# EAGLE design MicroWordClock2 (EAGLE 9.4.2)
Assembly variants: Wordface

## Sheet 1 of 3: COMPUTE
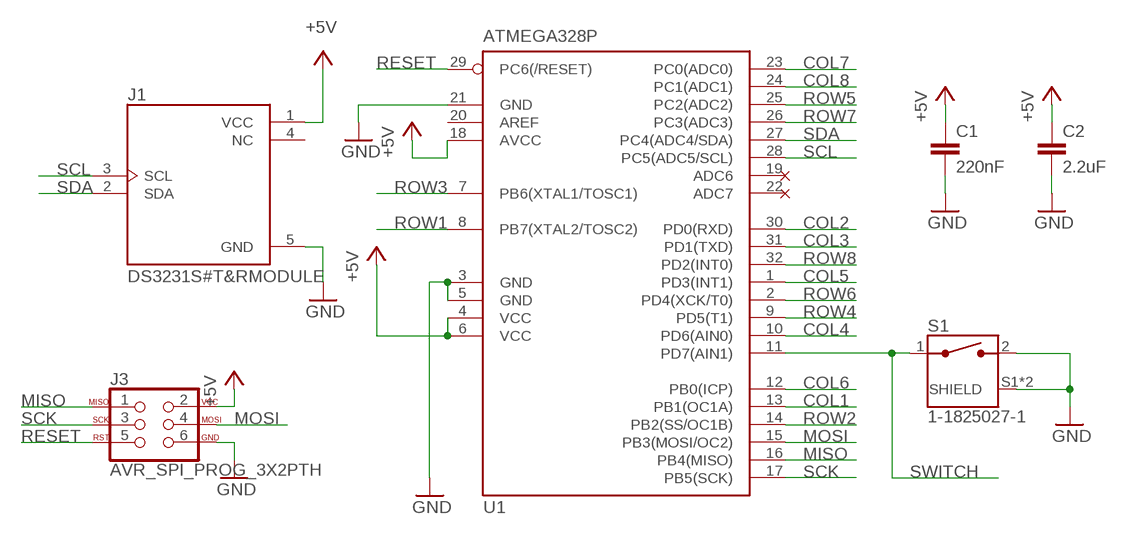
[diagram p0: schematic, sheet 1]

### Parts
C1  220nF  C-EUC0603  [C0603]
C2  2.2uF  C-EUC0603  [C0603]
J1  DS3231S#T&RMODULE  [1X05]
J3  AVR_SPI_PROG_3X2PTH  [2X3]
S1  1-1825027-1  [SW_1-1825027-1]
U1  ATMEGA328P  MEGA8-AI  [TQFP32-08]

### Nets
+5V: C1.1 C2.1 J1.1(VCC) J3.2 U1.4(VCC) U1.6(VCC) U1.18(AVCC) ; also sheet 3
COL1: U1.13(PB1(OC1A)) ; also sheet 2
COL2: U1.30(PD0(RXD)) ; also sheet 2
COL3: U1.31(PD1(TXD)) ; also sheet 2
COL4: U1.10(PD6(AIN0)) ; also sheet 2
COL5: U1.1(PD3(INT1)) ; also sheet 2
COL6: U1.12(PB0(ICP)) ; also sheet 2
COL7: U1.23(PC0(ADC0)) ; also sheet 2
COL8: U1.24(PC1(ADC1)) ; also sheet 2
GND: C1.2 C2.2 J1.5(GND) J3.6 S1.2 S1.S1(SHIELD) S1.S2(SHIELD) U1.3(GND) U1.5(GND) U1.21(GND) ; also sheet 3
MISO: J3.1 U1.16(PB4(MISO))
MOSI: J3.4 U1.15(PB3(MOSI/OC2))
RESET: J3.5 U1.29(PC6(/RESET))
ROW1: U1.8(PB7(XTAL2/TOSC2)) ; also sheet 2
ROW2: U1.14(PB2(SS/OC1B)) ; also sheet 2
ROW3: U1.7(PB6(XTAL1/TOSC1)) ; also sheet 2
ROW4: U1.9(PD5(T1)) ; also sheet 2
ROW5: U1.25(PC2(ADC2)) ; also sheet 2
ROW6: U1.2(PD4(XCK/T0)) ; also sheet 2
ROW7: U1.26(PC3(ADC3)) ; also sheet 2
ROW8: U1.32(PD2(INT0)) ; also sheet 2
SCK: J3.3 U1.17(PB5(SCK))
SCL: J1.3(SCL) U1.28(PC5(ADC5/SCL))
SDA: J1.2(SDA) U1.27(PC4(ADC4/SDA))
SWITCH: S1.1 U1.11(PD7(AIN1)) ; also sheet 3
Unconnected: J1.4(NC) U1.19(ADC6) U1.20(AREF) U1.22(ADC7)

## Sheet 2 of 3: MULTIPLEXED LEDS
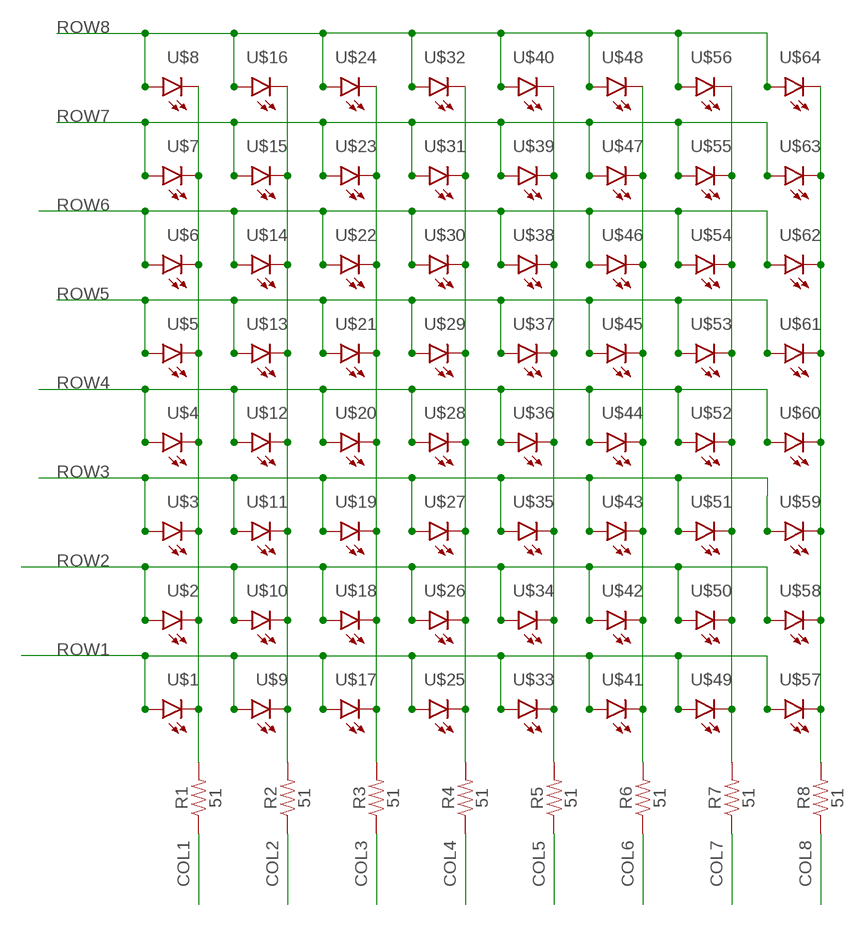
[diagram p1: schematic, sheet 2]

### Parts
R1  51  470OHM-0603-1/10W-1%  [0603]
R2  51  470OHM-0603-1/10W-1%  [0603]
R3  51  470OHM-0603-1/10W-1%  [0603]
R4  51  470OHM-0603-1/10W-1%  [0603]
R5  51  470OHM-0603-1/10W-1%  [0603]
R6  51  470OHM-0603-1/10W-1%  [0603]
R7  51  470OHM-0603-1/10W-1%  [0603]
R8  51  470OHM-0603-1/10W-1%  [0603]
U$1  WHITE  JE2835AWT-00-0000-0B0A0BG840E  [1113(2835METRIC)]
U$2  WHITE  JE2835AWT-00-0000-0B0A0BG840E  [1113(2835METRIC)]
U$3  WHITE  JE2835AWT-00-0000-0B0A0BG840E  [1113(2835METRIC)]
U$4  WHITE  JE2835AWT-00-0000-0B0A0BG840E  [1113(2835METRIC)]
U$5  WHITE  JE2835AWT-00-0000-0B0A0BG840E  [1113(2835METRIC)]
U$6  WHITE  JE2835AWT-00-0000-0B0A0BG840E  [1113(2835METRIC)]
U$7  WHITE  JE2835AWT-00-0000-0B0A0BG840E  [1113(2835METRIC)]
U$8  WHITE  JE2835AWT-00-0000-0B0A0BG840E  [1113(2835METRIC)]
U$9  WHITE  JE2835AWT-00-0000-0B0A0BG840E  [1113(2835METRIC)]
U$10  WHITE  JE2835AWT-00-0000-0B0A0BG840E  [1113(2835METRIC)]
U$11  WHITE  JE2835AWT-00-0000-0B0A0BG840E  [1113(2835METRIC)]
U$12  WHITE  JE2835AWT-00-0000-0B0A0BG840E  [1113(2835METRIC)]
U$13  WHITE  JE2835AWT-00-0000-0B0A0BG840E  [1113(2835METRIC)]
U$14  WHITE  JE2835AWT-00-0000-0B0A0BG840E  [1113(2835METRIC)]
U$15  WHITE  JE2835AWT-00-0000-0B0A0BG840E  [1113(2835METRIC)]
U$16  WHITE  JE2835AWT-00-0000-0B0A0BG840E  [1113(2835METRIC)]
U$17  WHITE  JE2835AWT-00-0000-0B0A0BG840E  [1113(2835METRIC)]
U$18  WHITE  JE2835AWT-00-0000-0B0A0BG840E  [1113(2835METRIC)]
U$19  WHITE  JE2835AWT-00-0000-0B0A0BG840E  [1113(2835METRIC)]
U$20  WHITE  JE2835AWT-00-0000-0B0A0BG840E  [1113(2835METRIC)]
U$21  WHITE  JE2835AWT-00-0000-0B0A0BG840E  [1113(2835METRIC)]
U$22  WHITE  JE2835AWT-00-0000-0B0A0BG840E  [1113(2835METRIC)]
U$23  WHITE  JE2835AWT-00-0000-0B0A0BG840E  [1113(2835METRIC)]
U$24  WHITE  JE2835AWT-00-0000-0B0A0BG840E  [1113(2835METRIC)]
U$25  WHITE  JE2835AWT-00-0000-0B0A0BG840E  [1113(2835METRIC)]
U$26  WHITE  JE2835AWT-00-0000-0B0A0BG840E  [1113(2835METRIC)]
U$27  WHITE  JE2835AWT-00-0000-0B0A0BG840E  [1113(2835METRIC)]
U$28  WHITE  JE2835AWT-00-0000-0B0A0BG840E  [1113(2835METRIC)]
U$29  WHITE  JE2835AWT-00-0000-0B0A0BG840E  [1113(2835METRIC)]
U$30  WHITE  JE2835AWT-00-0000-0B0A0BG840E  [1113(2835METRIC)]
U$31  WHITE  JE2835AWT-00-0000-0B0A0BG840E  [1113(2835METRIC)]
U$32  WHITE  JE2835AWT-00-0000-0B0A0BG840E  [1113(2835METRIC)]
U$33  WHITE  JE2835AWT-00-0000-0B0A0BG840E  [1113(2835METRIC)]
U$34  WHITE  JE2835AWT-00-0000-0B0A0BG840E  [1113(2835METRIC)]
U$35  WHITE  JE2835AWT-00-0000-0B0A0BG840E  [1113(2835METRIC)]
U$36  WHITE  JE2835AWT-00-0000-0B0A0BG840E  [1113(2835METRIC)]  (not fitted in variant Wordface)
U$37  WHITE  JE2835AWT-00-0000-0B0A0BG840E  [1113(2835METRIC)]
U$38  WHITE  JE2835AWT-00-0000-0B0A0BG840E  [1113(2835METRIC)]
U$39  WHITE  JE2835AWT-00-0000-0B0A0BG840E  [1113(2835METRIC)]
U$40  WHITE  JE2835AWT-00-0000-0B0A0BG840E  [1113(2835METRIC)]
U$41  WHITE  JE2835AWT-00-0000-0B0A0BG840E  [1113(2835METRIC)]
U$42  WHITE  JE2835AWT-00-0000-0B0A0BG840E  [1113(2835METRIC)]
U$43  WHITE  JE2835AWT-00-0000-0B0A0BG840E  [1113(2835METRIC)]
U$44  WHITE  JE2835AWT-00-0000-0B0A0BG840E  [1113(2835METRIC)]
U$45  WHITE  JE2835AWT-00-0000-0B0A0BG840E  [1113(2835METRIC)]
U$46  WHITE  JE2835AWT-00-0000-0B0A0BG840E  [1113(2835METRIC)]
U$47  WHITE  JE2835AWT-00-0000-0B0A0BG840E  [1113(2835METRIC)]
U$48  WHITE  JE2835AWT-00-0000-0B0A0BG840E  [1113(2835METRIC)]
U$49  WHITE  JE2835AWT-00-0000-0B0A0BG840E  [1113(2835METRIC)]
U$50  WHITE  JE2835AWT-00-0000-0B0A0BG840E  [1113(2835METRIC)]
U$51  WHITE  JE2835AWT-00-0000-0B0A0BG840E  [1113(2835METRIC)]
U$52  WHITE  JE2835AWT-00-0000-0B0A0BG840E  [1113(2835METRIC)]
U$53  WHITE  JE2835AWT-00-0000-0B0A0BG840E  [1113(2835METRIC)]
U$54  WHITE  JE2835AWT-00-0000-0B0A0BG840E  [1113(2835METRIC)]
U$55  WHITE  JE2835AWT-00-0000-0B0A0BG840E  [1113(2835METRIC)]
U$56  WHITE  JE2835AWT-00-0000-0B0A0BG840E  [1113(2835METRIC)]
U$57  WHITE  JE2835AWT-00-0000-0B0A0BG840E  [1113(2835METRIC)]
U$58  WHITE  JE2835AWT-00-0000-0B0A0BG840E  [1113(2835METRIC)]
U$59  WHITE  JE2835AWT-00-0000-0B0A0BG840E  [1113(2835METRIC)]  (not fitted in variant Wordface)
U$60  WHITE  JE2835AWT-00-0000-0B0A0BG840E  [1113(2835METRIC)]  (not fitted in variant Wordface)
U$61  WHITE  JE2835AWT-00-0000-0B0A0BG840E  [1113(2835METRIC)]
U$62  WHITE  JE2835AWT-00-0000-0B0A0BG840E  [1113(2835METRIC)]
U$63  WHITE  JE2835AWT-00-0000-0B0A0BG840E  [1113(2835METRIC)]
U$64  WHITE  JE2835AWT-00-0000-0B0A0BG840E  [1113(2835METRIC)]

### Nets
COL1: R1.1 ; also sheet 1
COL2: R2.1 ; also sheet 1
COL3: R3.1 ; also sheet 1
COL4: R4.1 ; also sheet 1
COL5: R5.1 ; also sheet 1
COL6: R6.1 ; also sheet 1
COL7: R7.1 ; also sheet 1
COL8: R8.1 ; also sheet 1
EE: R8.2 U$57.CATHODE(C) U$58.CATHODE(C) U$59.CATHODE(C) U$60.CATHODE(C) U$61.CATHODE(C) U$62.CATHODE(C) U$63.CATHODE(C) U$64.CATHODE(C)
N$5: R3.2 U$17.CATHODE(C) U$18.CATHODE(C) U$19.CATHODE(C) U$20.CATHODE(C) U$21.CATHODE(C) U$22.CATHODE(C) U$23.CATHODE(C) U$24.CATHODE(C)
N$6: R4.2 U$25.CATHODE(C) U$26.CATHODE(C) U$27.CATHODE(C) U$28.CATHODE(C) U$29.CATHODE(C) U$30.CATHODE(C) U$31.CATHODE(C) U$32.CATHODE(C)
N$7: R5.2 U$33.CATHODE(C) U$34.CATHODE(C) U$35.CATHODE(C) U$36.CATHODE(C) U$37.CATHODE(C) U$38.CATHODE(C) U$39.CATHODE(C) U$40.CATHODE(C)
N$8: R6.2 U$41.CATHODE(C) U$42.CATHODE(C) U$43.CATHODE(C) U$44.CATHODE(C) U$45.CATHODE(C) U$46.CATHODE(C) U$47.CATHODE(C) U$48.CATHODE(C)
N$9: R7.2 U$49.CATHODE(C) U$50.CATHODE(C) U$51.CATHODE(C) U$52.CATHODE(C) U$53.CATHODE(C) U$54.CATHODE(C) U$55.CATHODE(C) U$56.CATHODE(C)
N$11: R1.2 U$1.CATHODE(C) U$2.CATHODE(C) U$3.CATHODE(C) U$4.CATHODE(C) U$5.CATHODE(C) U$6.CATHODE(C) U$7.CATHODE(C) U$8.CATHODE(C)
N$15: R2.2 U$9.CATHODE(C) U$10.CATHODE(C) U$11.CATHODE(C) U$12.CATHODE(C) U$13.CATHODE(C) U$14.CATHODE(C) U$15.CATHODE(C) U$16.CATHODE(C)
ROW1: U$1.ANODE(A) U$9.ANODE(A) U$17.ANODE(A) U$25.ANODE(A) U$33.ANODE(A) U$41.ANODE(A) U$49.ANODE(A) U$57.ANODE(A) ; also sheet 1
ROW2: U$2.ANODE(A) U$10.ANODE(A) U$18.ANODE(A) U$26.ANODE(A) U$34.ANODE(A) U$42.ANODE(A) U$50.ANODE(A) U$58.ANODE(A) ; also sheet 1
ROW3: U$3.ANODE(A) U$11.ANODE(A) U$19.ANODE(A) U$27.ANODE(A) U$35.ANODE(A) U$43.ANODE(A) U$51.ANODE(A) U$59.ANODE(A) ; also sheet 1
ROW4: U$4.ANODE(A) U$12.ANODE(A) U$20.ANODE(A) U$28.ANODE(A) U$36.ANODE(A) U$44.ANODE(A) U$52.ANODE(A) U$60.ANODE(A) ; also sheet 1
ROW5: U$5.ANODE(A) U$13.ANODE(A) U$21.ANODE(A) U$29.ANODE(A) U$37.ANODE(A) U$45.ANODE(A) U$53.ANODE(A) U$61.ANODE(A) ; also sheet 1
ROW6: U$6.ANODE(A) U$14.ANODE(A) U$22.ANODE(A) U$30.ANODE(A) U$38.ANODE(A) U$46.ANODE(A) U$54.ANODE(A) U$62.ANODE(A) ; also sheet 1
ROW7: U$7.ANODE(A) U$15.ANODE(A) U$23.ANODE(A) U$31.ANODE(A) U$39.ANODE(A) U$47.ANODE(A) U$55.ANODE(A) U$63.ANODE(A) ; also sheet 1
ROW8: U$8.ANODE(A) U$16.ANODE(A) U$24.ANODE(A) U$32.ANODE(A) U$40.ANODE(A) U$48.ANODE(A) U$56.ANODE(A) U$64.ANODE(A) ; also sheet 1

## Sheet 3 of 3: HEADERS
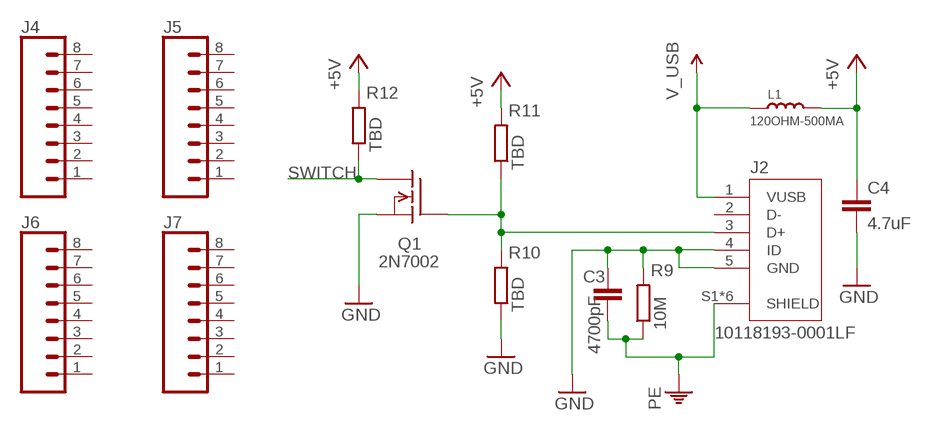
[diagram p2: schematic, sheet 3]

### Parts
C3  4700pF  C-EUC0603  [C0603]
C4  4.7uF  C-EUC0603  [C0603]
J2  10118193-0001LF  [FCI_10118193-0001LF]
J4  CONN_08"  [1X08]
J5  CONN_08"  [1X08]
J6  CONN_08"  [1X08]
J7  CONN_08"  [1X08]
L1  120OHM-500MA  SMD-FERRITE-CHIP-120-OHM-500MA(0603)  [L0603]
Q1  2N7002  [SOT23]
R9  10M  R-EU_R0603  [R0603]
R10  TBD  R-EU_R0603  [R0603]
R11  TBD  R-EU_R0603  [R0603]
R12  TBD  R-EU_R0603  [R0603]

### Nets
+5V: C4.1 L1.2 R11.2 R12.2 ; also sheet 1
GND: C3.1 C4.2 J2.4(ID) J2.5(GND) Q1.2(S) R9.2 R10.1 ; also sheet 1
N$1: J2.3(D+) Q1.1(G) R10.2 R11.1
PE: C3.2 J2.S1(SHIELD) J2.S2(SHIELD) J2.S3(SHIELD) J2.S4(SHIELD) J2.S5(SHIELD) J2.S6(SHIELD) R9.1
SWITCH: Q1.3(D) R12.1 ; also sheet 1
V_USB: J2.1(VUSB) L1.1
Unconnected: J2.2(D-) J4.1 J4.2 J4.3 J4.4 J4.5 J4.6 J4.7 J4.8 J5.1 J5.2 J5.3 J5.4 J5.5 J5.6 J5.7 J5.8 J6.1 J6.2 J6.3 J6.4 J6.5 J6.6 J6.7 J6.8 J7.1 J7.2 J7.3 J7.4 J7.5 J7.6 J7.7 J7.8

## Library data of the parts
C1-C4 = rcl:C-EU: CAPACITOR, European symbol; SPICEPREFIX: C
J1 = DS3231:DS3231S#T&R: Real Time Clock Serial 16-Pin SOIC W T/R
J2 = 10118193-0001LF:10118193-0001LF: Micro USB B Type Receptacle; DESCRIPTION: Single Port 5 Contact Shielded SMT MICRO USB B-Type Receptacle; DIGI-KEY_PART_NUMBER: 609-4616-1-ND; DIGI-KEY_PURCHASE_URL: https://www.digikey.com/product-detail/en/amphenol-icc-fci/10118193-0001LF/609-4616-1-ND/2785380?utm_source=snapeda&utm_medium=aggregator&utm_campaign=symbol; MF: Amphenol ICC; MP: 10118193-0001LF; PACKAGE: None
J3 = SparkFun-Connectors:AVR_SPI_PROG_3X2: AVR ISP 6 Pin This is the reduced ISP connector for AVR programming. Common on Arduino. This footprint will take up less PCB space and can be used with a 10-pin to 6-pin adapter such as SKU: BOB-08508 **Special note about "TEST_POINT" package. The stop mask is on the top side, so if you want your programming test points to be on the bottom of your board, make sure to place this package on the bottom side of the board. This also ensure that the orientation to program from the bottom side will be correct. SparkFun Products: SparkFun ISP Pogo Adapter <https://www.sparkfun.com/products/11591> - NS Tiny AVR Programmer <https://www.sparkfun.com/products/11801> -PTH
J4-J7 = SparkFun-Connectors:CONN_08: Multi connection point. Often used as Generic Header-pin footprint for 0.1 inch spaced/style header connections On any of the 0.1 inch spaced packages, you can populate with these: Break Away Headers - Straight <https://www.sparkfun.com/products/116> (PRT-00116) Break Away Male Headers - Right Angle <https://www.sparkfun.com/products/553> (PRT-00553) Female Headers <https://www.sparkfun.com/products/115> (PRT-00115) Break Away Headers - Machine Pin <https://www.sparkfun.com/products/117> (PRT-00117) Break Away Female Headers - Swiss Machine Pin <https://www.sparkfun.com/products/743> (PRT-00743) Arduino Stackable Header - 8 Pin <https://www.sparkfun.com/products/9279> (PRT-09279) For SCREWTERMINALS and SPRING TERMINALS visit here: Screw Terimnals on SparkFun.com <https://www.sparkfun.com/search/results?term=Screw+Terminals> (5mm/3.5mm/2.54mm spacing) This device is also useful as a general connection point to wire up your design to another part of your project. Our various solder wires solder well into these plated through hole pads. Hook-Up Wire - Assortment (Stranded, 22 AWG) <https://www.sparkfun.com/products/11375> (PRT-11375) Hook-Up Wire - Assortment (Solid Core, 22 AWG) <https://www.sparkfun.com/products/11367> (PRT-11367) View the entire wire category on our website here <https://www.sparkfun.com/categories/141> Special notes: Molex polarized connector foot print use with SKU : PRT-08231 with associated crimp pins and housings. 1MM SMD Version SKU: PRT-10208 NOTES ON THE VARIANTS LOCK and LOCK_LONGPADS... This footprint was designed to help hold the alignment of a through-hole component (i.e. 6-pin header) while soldering it into place. You may notice that each hole has been shifted either up or down by 0.005 of an inch from it's more standard position (which is a perfectly straight line). This slight alteration caused the pins (the squares in the middle) to touch the edges of the holes. Because they are alternating, it causes a "brace" to hold the component in place. 0.005 has proven to be the perfect amount of "off-center" position when using our standard breakaway headers. Although looks a little odd when you look at the bare footprint, once you have a header in there, the alteration is very hard to notice. Also,if you push a header all the way into place, it is covered up entirely on the bottom side.; PROD_ID: CONN-08438
L1 = OPL_Ferrite_and_Magnetic_Bead:SMD-FERRITE-CHIP-120-OHM-500MA(0603): 303030001; MPN: BLM18AG121SN1D
Q1 = 2N7002:2N7002; AVAILABILITY: Unavailable; DESCRIPTION: Transistor NPN Mos 2N7002 SILICONIX miliampere=100 V=60 SOt23; MF: STMicroelectronics; MP: 2N7002; PACKAGE: SOT-23-3 Vishay; PRICE: None
R1-R8 = SparkFun-Resistors:470OHM: 470Ω resistor A resistor is a passive two-terminal electrical component that implements electrical resistance as a circuit element. Resistors act to reduce current flow, and, at the same time, act to lower voltage levels within circuits. - Wikipedia; PROD_ID: RES-07869; VALUE: 470
R9-R12 = rcl:R-EU_: RESISTOR, European symbol; SPICEPREFIX: R
S1 = 1-1825027-1:1-1825027-1: Switch Push Button OFF (ON) SPST Round Button 0.05A 24VDC Momentary Contact PC Pins Thru-Hole; COMMENT: 1-1825027-1; DESCRIPTION: Switch Push Button OFF _ON_ SPST Round Button 0.05A 24VDC Momentary Contact PC Pins Thru-Hole; DIGI-KEY_PART_NUMBER: 450-1658-ND; DIGI-KEY_PURCHASE_URL: https://www.digikey.com/product-detail/en/te-connectivity-alcoswitch-switches/1-1825027-1/450-1658-ND/1632544?utm_source=snapeda&utm_medium=aggregator&utm_campaign=symbol; EU_ROHS_COMPLIANCE: Compliant; MF: TE Connectivity; MP: 1-1825027-1; PACKAGE: None; TE_PURCHASE_URL: https://www.te.com/usa-en/product-1-1825027-1.html?te_bu=Cor&te_type=disp&te_campaign=seda_glo_cor-seda-global-disp-prtnr-fy19-seda-model-bom-cta_sma-317_1&elqCampaignId=32493
U1 = atmel:MEGA8: MICROCONTROLLER 8 Kbytes FLASH, 1 kbytes SRAM, 512 bytes EEPROM, USART, 6-channel 10 bit ADC, 2-channel 8 bit ADC Pin compatible with Atmega48, ATMega88, ATMega168 Source: avr.lbr; MPN: ATMEGA8-16AU; OC_FARNELL: 9171371; OC_NEWARK: 73M8863
U$1-U$64 = TULIP_GIZMO:JE2835AWT-00-0000-0B0A0BG840E

## Board
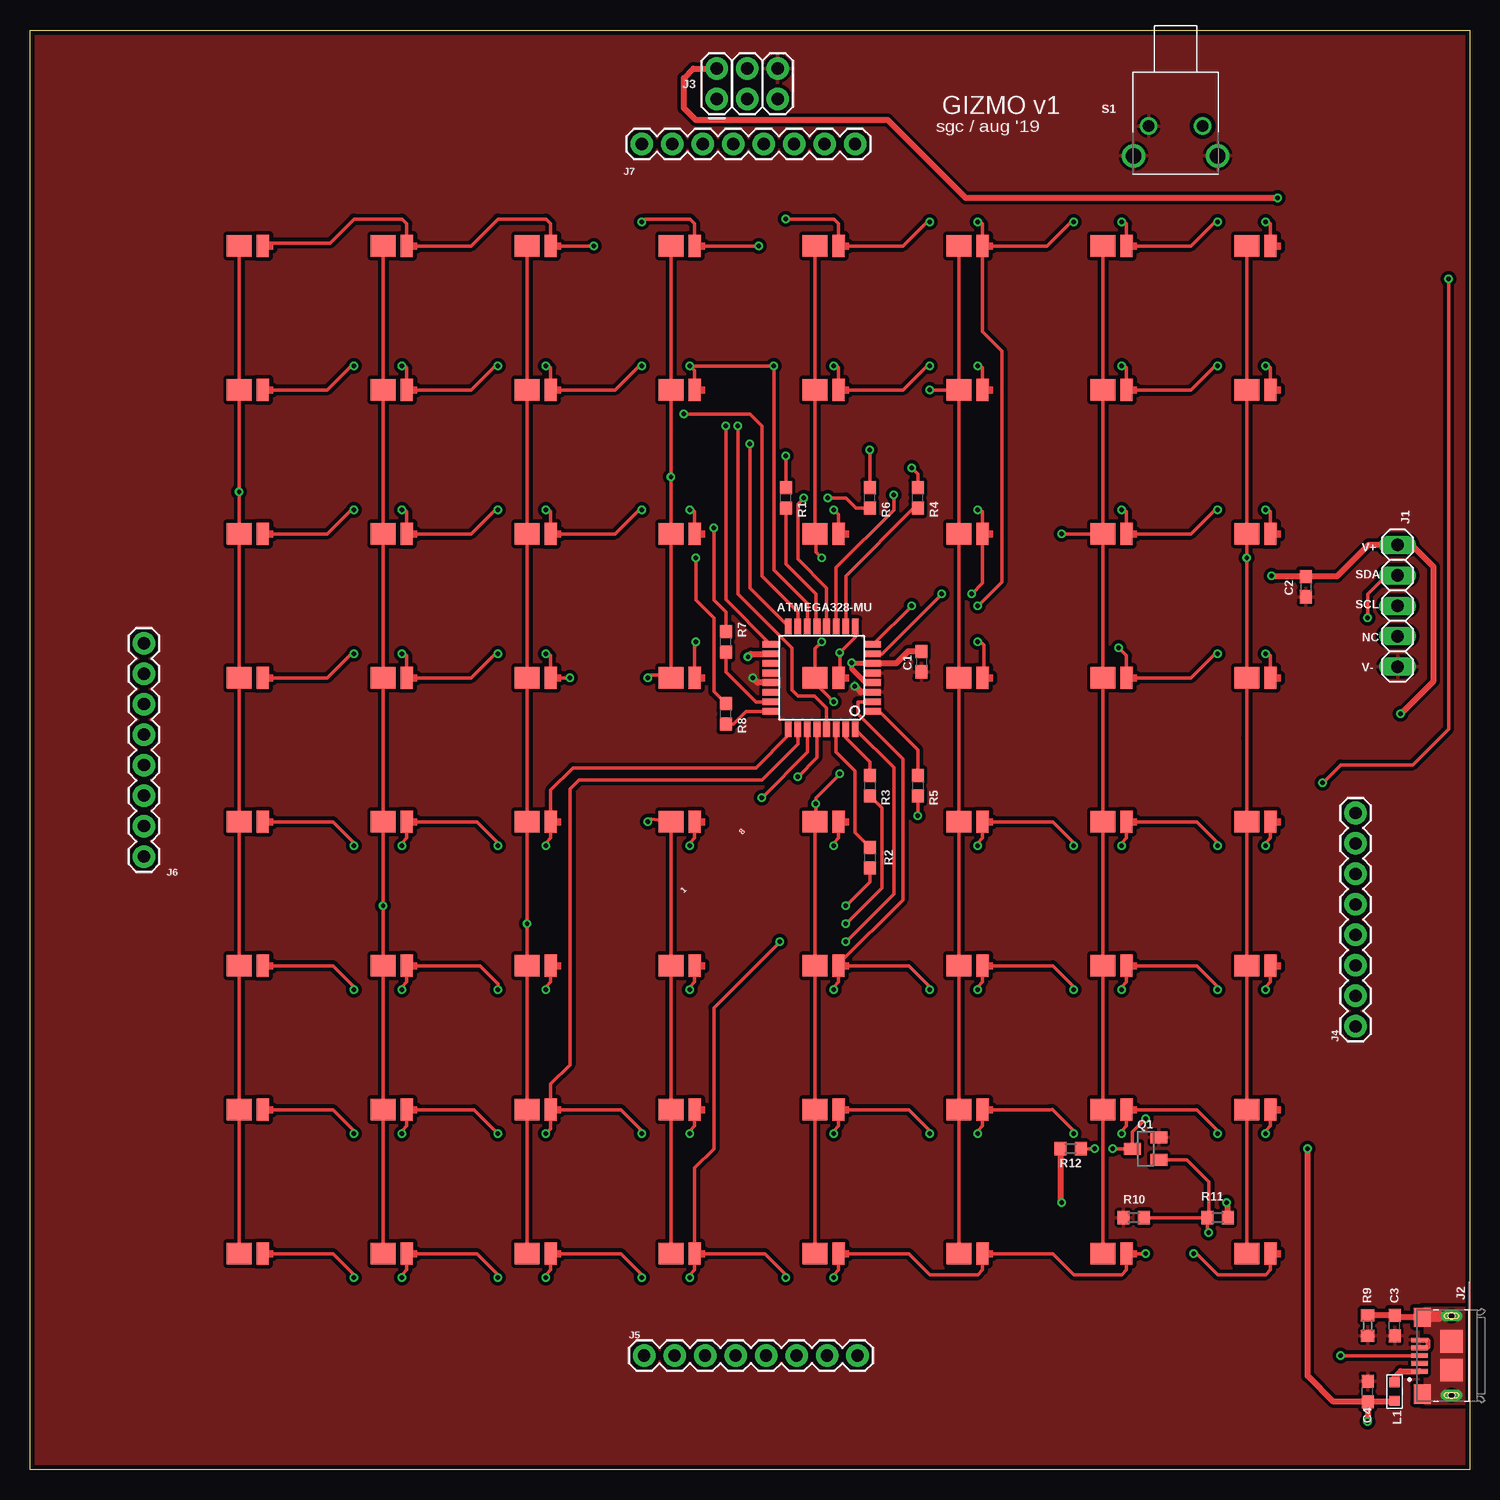
[diagram p3: board, top side]
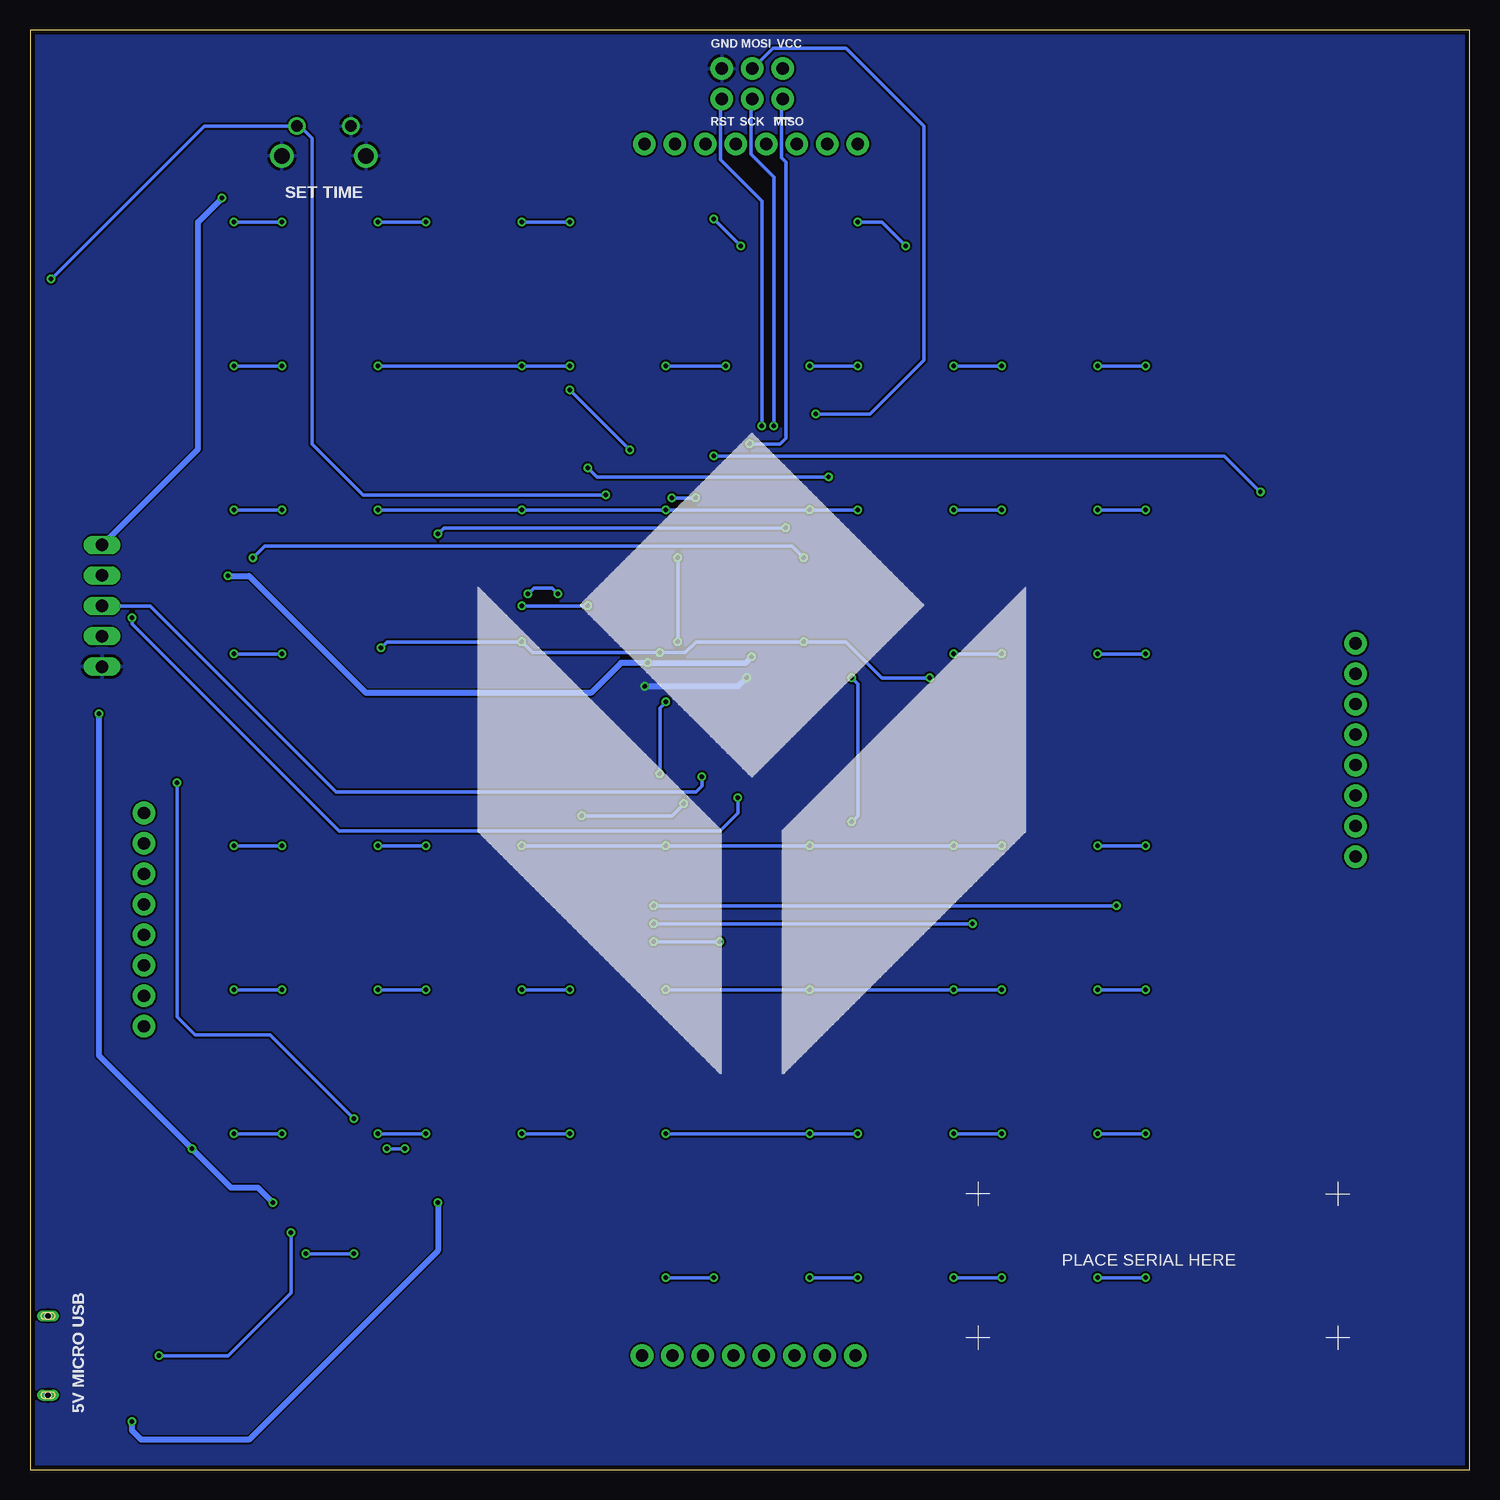
[diagram p4: board, bottom side, seen from below]

Size 120 x 120 mm. Coordinates in mm from the lower left corner, seen from the top.
Outline: 0,0 0,120 120,120 120,0 0,0
Copper layers (1*16): Top 0.0356mm / dielectric 1.5011mm / Bottom 0.0356mm
Design rules "LaenPCBOrder *": minimum track width 6mil, minimum drill 13mil, track to track 6mil, track to pad 6mil, pad to pad 6mil, via to via 6mil, smd to smd 6mil, copper to edge 15mil, drill to drill 6mil, minimum pad ring 7mil, minimum via ring 7mil, stop-mask expansion 3mil, vias tented up to drill 0.35mm, thermal gap 10mil

### Footprints (pad centres in the part's own frame; a part is rotated, then mirrored left to right if it is on the bottom)
C0603 = smd 1.1 x 1: 1 -0.85,0; 2 0.85,0
1X05 = drill 1.016 long: 1 -5.08,0; 2 -2.54,0; 3 0,0; 4 2.54,0; 5 5.08,0
FCI_10118193-0001LF = smd 0.4 x 1.35: 1 -1.3,2.675; 2 -0.65,2.675; 3 0,2.675; 4 0.65,2.675; 5 1.3,2.675 | smd 1.6 x 1.4: S1 -3.2,2.45; S2 3.2,2.45 | smd 1.9 x 1.9: S3 1.2,0; S4 -1.2,0 | drill 0.5 pad 0.9 long: S5 -3.3,0; S6 3.3,0 | hole 0.5: -3.3,0; 3.3,0
2X3 = drill 1.016 pad 1.88: 1 0,0; 2 0,2.54; 3 2.54,0; 4 2.54,2.54; 5 5.08,0; 6 5.08,2.54
1X08 = drill 1.016 pad 1.88: 1 0,0; 2 2.54,0; 3 5.08,0; 4 7.62,0; 5 10.16,0; 6 12.7,0; 7 15.24,0; 8 17.78,0
L0603 = smd 0.889 x 0.889: 1 -0.762,0; 2 0.762,0
SOT23 = smd 1 x 1.4: 1 -0.95,-1.1; 2 0.95,-1.1; 3 0,1.1
0603 = smd 1.1 x 1: 1 -0.85,0; 2 0.85,0
R0603 = smd 1 x 1.1: 1 -0.85,0; 2 0.85,0
SW_1-1825027-1 = drill 0.99: 1 -2.25,0; 2 2.25,0 | drill 1.3: S1 -3.505,2.49; S2 3.505,2.49
TQFP32-08 = smd 1.27 x 0.559: 1 -4.293,2.8; 2 -4.293,2; 3 -4.293,1.2; 4 -4.293,0.4; 5 -4.293,-0.4; 6 -4.293,-1.2; 7 -4.293,-2; 8 -4.293,-2.8; 17 4.293,-2.8; 18 4.293,-2; 19 4.293,-1.2; 20 4.293,-0.4; 21 4.293,0.4; 22 4.293,1.2; 23 4.293,2; 24 4.293,2.8 | smd 0.559 x 1.27: 9 -2.8,-4.293; 10 -2,-4.293; 11 -1.2,-4.293; 12 -0.4,-4.293; 13 0.4,-4.293; 14 1.2,-4.293; 15 2,-4.293; 16 2.8,-4.293; 25 2.8,4.293; 26 2,4.293; 27 1.2,4.293; 28 0.4,4.293; 29 -0.4,4.293; 30 -1.2,4.293; 31 -2,4.293; 32 -2.8,4.293
1113(2835METRIC) = smd 0.99 x 1.8: ANODE 1.405,0 | smd 2.06 x 1.8: CATHODE -0.57,0

### Placement (x,y rotation side)
C1  74.3,67.35 270 top
C2  106.35,73.6 270 top
C3  113.75,12 90 top
C4  111.5,6.5 90 top
J1  114,72 270 top
J2  118.5,9.5 90 top
J3  57.25,114.25 0 top
J4  110.5,36.95 90 top
J5  51.2,9.5 0 top
J6  9.5,51.1 90 top
J7  51,110.5 0 top
L1  113.75,6.5 270 top
Q1  93,26.75 90 top
R1  63,81 90 top
R2  70,51 270 top
R3  70,57 270 top
R4  74,81 90 top
R5  74,57 270 top
R6  70,81 90 top
R7  58,69 90 top
R8  58,63 90 top
R9  111.5,12 270 top
R10  92,21 0 top
R11  99,21 0 top
R12  86.75,26.75 180 top
S1  95.5,112 180 top
U1  66,66 180 top
U$1  18,102 0 top
U$2  18,90 0 top
U$3  18,78 0 top
U$4  18,66 0 top
U$5  18,54 0 top
U$6  18,42 0 top
U$7  18,30 0 top
U$8  18,18 0 top
U$9  30,102 0 top
U$10  30,90 0 top
U$11  30,78 0 top
U$12  30,66 0 top
U$13  30,54 0 top
U$14  30,42 0 top
U$15  30,30 0 top
U$16  30,18 0 top
U$17  42,102 0 top
U$18  42,90 0 top
U$19  42,78 0 top
U$20  42,66 0 top
U$21  42,54 0 top
U$22  42,42 0 top
U$23  42,30 0 top
U$24  42,18 0 top
U$25  54,102 0 top
U$26  54,90 0 top
U$27  54,78 0 top
U$28  54,66 0 top
U$29  54,54 0 top
U$30  54,42 0 top
U$31  54,30 0 top
U$32  54,18 0 top
U$33  66,102 0 top
U$34  66,90 0 top
U$35  66,78 0 top
U$36  66,66 0 top
U$37  66,54 0 top
U$38  66,42 0 top
U$39  66,30 0 top
U$40  66,18 0 top
U$41  78,102 0 top
U$42  78,90 0 top
U$43  78,78 0 top
U$44  78,66 0 top
U$45  78,54 0 top
U$46  78,42 0 top
U$47  78,30 0 top
U$48  78,18 0 top
U$49  90,102 0 top
U$50  90,90 0 top
U$51  90,78 0 top
U$52  90,66 0 top
U$53  90,54 0 top
U$54  90,42 0 top
U$55  90,30 0 top
U$56  90,18 0 top
U$57  102,102 0 top
U$58  102,90 0 top
U$59  102,78 0 top
U$60  102,66 0 top
U$61  102,54 0 top
U$62  102,42 0 top
U$63  102,30 0 top
U$64  102,18 0 top

### Tracks (layer width: path | path; a pad name or v marks a point on that pad's centre or on a via)
+5V  (via drill 0.35)
  Top 0.4: 69.65,65.6 68.5,66.75 v68.5,67.25 68.55,67.2 U1.6
  Top 0.5: L1.2 113.5,5.74 113.41,5.65 C4.1 | U1.4 69.65,65.6 | U1.6 72.2,67.2 73.2,68.2 C1.1 | C4.1 108.65,5.65 106.5,7.8 v106.5,26.75 | v104,106 78,106 71.5,112.5 55.5,112.5 54.5,113.5 54.5,116 55.29,116.79 J3.2 | v59.85,67.75 60.1,68 U1.18 | v103.5,74.5 103.55,74.45 C2.1 108.95,74.45 111.58,77.08 J1.1 115.17,77.08 117,75.25 117,65.75 v114.25,63 | R12.2 85.9,22.35 v86,22.25 | C4.1 v111.5,4 | R11.2 99.85,22.15 v99.75,22.25
  Bottom 0.5: v59.85,67.75 60.35,67.25 v68.5,67.25 70.75,67.25 73.25,64.75 92,64.75 101.75,74.5 v103.5,74.5 | J1.1 106,85.08 106,104 v104,106 | v114.25,63 114.25,34.5 v106.5,26.75 103.25,23.5 101,23.5 v99.75,22.25 | v86,22.25 86,18.25 101.75,2.5 110.75,2.5 111.5,3.25 v111.5,4
COL1
  Top 0.3: U1.13 65.5,70.39 65.5,73 63,75.5 R1.1
COL2
  Top 0.3: U1.30 67.2,59.8 68.75,58.25 68.75,53.1 R2.1
COL3
  Top 0.3: U1.31 68,61 70,59 R3.1
COL4
  Top 0.3: U1.10 68,74.5 73.65,80.15 R4.1
COL5
  Top 0.3: R5.1 74,60 70.8,63.2 U1.1
COL6  (via drill 0.35)
  Top 0.3: U1.12 66.4,73.5 64,75.9 64,80.5 v64.5,81 | v66.5,81 68,81 68.85,80.15 R6.1
  Bottom 0.3: v64.5,81 v66.5,81
COL7
  Top 0.3: U1.23 60.5,64 58,66.5 R7.1
COL8
  Top 0.3: U1.24 59.7,63.2 58.65,62.15 R8.1
EE  (via drill 0.35)
  Top 0.3: U$57.CATHODE U$58.CATHODE U$59.CATHODE v101.43,76 U$60.CATHODE 101.43,61 U$61.CATHODE U$62.CATHODE U$63.CATHODE U$64.CATHODE | R8.2 57,64.85 57,71 55.5,72.5 v55.5,76
  Bottom 0.3: v55.5,76 56.5,77 100.43,77 v101.43,76
GND  (via drill 0.35)
  Top 0.4: J2.4 116.5,10.15 116.5,10.8 J2.5
  Top 0.5: v60.25,66 60.65,65.6 U1.21 | U1.3 69.25,64.8 v68.75,65.3
  Bottom 0.5: v60.25,66 60.95,65.3 v68.75,65.3
  pour Top (isolate 0.3, rank 2): 0,0 0,120 120,120 120,0
  pour Bottom: 0,0 0,120 120,120 120,0
MISO  (via drill 0.35)
  Top 0.3: U1.16 60,73.49 v60,85.5
  Bottom 0.3: v60,85.5 57.5,85.5 57,86 57,109 57.35,109.35 57.35,114.15 J3.1
MOSI  (via drill 0.35)
  Top 0.3: U1.15 64,71.5 61,74.5 61,87 60,88 v54.5,88
  Bottom 0.3: J3.4 58.08,118.5 52,118.5 45.5,112 45.5,92.5 50,88 v54.5,88
N$1  (via drill 0.35)
  Top 0.3: J2.3 v109.25,9.5 | R11.1 98.25,21.1 98.25,24 96.45,25.8 Q1.1 | R10.2 R11.1 | R11.1 98.15,19.85 v98.25,19.75
  Bottom 0.3: v98.25,19.75 98.25,14.75 103.5,9.5 v109.25,9.5
N$5  (via drill 0.35)
  Top 0.3: U$17.CATHODE U$18.CATHODE U$19.CATHODE U$20.CATHODE U$21.CATHODE v41.43,45.5 U$22.CATHODE U$23.CATHODE U$24.CATHODE | R3.2 71,55.15 71,48.5 v68,45.5
  Bottom 0.3: v68,45.5 v41.43,45.5
N$6  (via drill 0.35)
  Top 0.3: U$25.CATHODE U$26.CATHODE v53.43,82.75 U$27.CATHODE 53.43,66.25 | U$32.CATHODE U$31.CATHODE U$30.CATHODE U$29.CATHODE 51.75,54.25 v51.5,54 | 53.43,66.25 51.75,66.25 v51.5,66 | U$28.CATHODE 53.43,66.25 | R4.2 74,83 v73.5,83.5
  Bottom 0.3: v51.5,66 51,65.5 51,54.5 v51.5,54 | v73.5,83.5 72.75,82.75 v53.43,82.75
N$7  (via drill 0.35)
  Top 0.3: U$33.CATHODE U$34.CATHODE U$35.CATHODE 65.5,77.93 65.5,76.5 v66,76 | U$40.CATHODE U$39.CATHODE U$38.CATHODE U$37.CATHODE 65.5,54.07 v65.5,55.5 65.5,56 v67.5,58 | R5.2 v74,54.5 | v66,69 65.43,68.43 U$36.CATHODE 65.43,65.57 v67,64
  Bottom 0.3: v66,76 v66,69 | v65.5,55.5 66.5,54.5 v74,54.5 | v67,64 67.5,63.5 v67.5,58
N$8  (via drill 0.35)
  Top 0.3: U$48.CATHODE U$47.CATHODE U$46.CATHODE U$45.CATHODE U$44.CATHODE U$43.CATHODE U$42.CATHODE | U$42.CATHODE U$41.CATHODE | U$42.CATHODE v75,90 | v70,85 R6.2
  Bottom 0.3: v75,90 v70,85
N$9  (via drill 0.35)
  Top 0.3: U$51.CATHODE U$52.CATHODE U$53.CATHODE U$54.CATHODE U$55.CATHODE U$56.CATHODE | U$49.CATHODE U$50.CATHODE U$51.CATHODE | R7.2 58,71.5 57,72.5 v57,78.5 | U$51.CATHODE v86,78
  Bottom 0.3: v86,78 85.5,78.5 v57,78.5
N$11  (via drill 0.35)
  Top 0.3: U$1.CATHODE U$2.CATHODE v17.43,81.5 U$3.CATHODE U$4.CATHODE U$5.CATHODE U$6.CATHODE U$7.CATHODE U$8.CATHODE | R1.2 v63,84.5
  Bottom 0.3: v63,84.5 20.43,84.5 v17.43,81.5
N$15  (via drill 0.35)
  Top 0.3: U$9.CATHODE U$10.CATHODE U$11.CATHODE U$12.CATHODE U$13.CATHODE v29.43,47 U$14.CATHODE U$15.CATHODE U$16.CATHODE | R2.2 70,49 v68,47
  Bottom 0.3: v68,47 v29.43,47
PE
  Top 0.5: R9.1 C3.2 113.65,12.7 J2.S2
  Top 1: J2.S2 116.15,12.8 117.37,12.8
  pour Top (isolate 0.3, no thermals): 120,5.5 116.25,5.5 116.25,13.5 120,13.5
RESET  (via drill 0.35)
  Top 0.3: U1.29 66.4,63.5 65.4,64.5 64,64.5 63.5,65 63.5,68.5 59,73 v59,87
  Bottom 0.3: J3.5 62.45,114.13 62.45,109.2 59,105.75 v59,87
ROW1  (via drill 0.35)
  Top 0.3: U$1.ANODE 19.66,102.25 25,102.25 27,104.25 31,104.25 31.41,103.84 U$9.ANODE 36.75,102 39,104.25 43,104.25 43.41,103.84 U$17.ANODE v47,102 | v51,104 51.25,104.25 55,104.25 55.41,103.84 U$25.ANODE v60.75,102 | v63,104.25 67,104.25 67.41,103.84 U$33.ANODE 72.75,102 74.75,104 v75,104 | v79,104 79.25,104 79.41,103.84 U$41.ANODE | v87,104 86.75,104 84.75,102 U$41.ANODE | v91,104 91.25,104 91.41,103.84 U$49.ANODE 96.75,102 98.75,104 v99,104 | v103,104 103.25,104 103.41,103.84 U$57.ANODE | U$41.ANODE 79.41,94.84 81,93.25 81,74 v79,72 | U1.8 v73.5,72
  Bottom 0.3: v47,102 49,104 v51,104 | v75,104 v79,104 | v87,104 v91,104 | v99,104 v103,104 | v60.75,102 v63,104.25 | v73.5,72 v79,72
ROW2  (via drill 0.35)
  Top 0.3: v39,92 38.75,92 36.75,90 U$10.ANODE 31.41,91.84 31.25,92 v31,92 | v43,92 43.25,92 43.41,91.84 U$18.ANODE 48.75,90 50.75,92 v51,92 | U$2.ANODE 24.75,90 26.75,92 v27,92 | v67,92 67.25,92 67.41,91.84 U$34.ANODE 72.75,90 74.75,92 v75,92 | v79,92 79.25,92 79.41,91.84 U$42.ANODE | v91,92 91.25,92 91.41,91.84 U$50.ANODE 96.75,90 98.75,92 v99,92 | v103,92 103.25,92 103.41,91.84 U$58.ANODE | 62,91.75 v62,92 | U$26.ANODE 55.41,91.59 v55,92 61.75,92 62,91.75 | U1.14 64.8,72.2 62,75 62,91.75
  Bottom 0.3: v39,92 v43,92 | v27,92 v31,92 | v51,92 v55,92 | v62,92 v67,92 | v75,92 v79,92 v91,92 | v99,92 v103,92
ROW3  (via drill 0.35)
  Top 0.3: v39,80 38.75,80 36.75,78 U$11.ANODE 31.41,79.84 31.25,80 v31,80 | v43,80 43.25,80 43.41,79.84 U$19.ANODE 48.75,78 50.75,80 v51,80 | U$3.ANODE 24.75,78 26.75,80 v27,80 | v55,80 55.25,80 55.41,79.84 U$27.ANODE | v79,80 79.25,80 79.41,79.84 U$43.ANODE 79.41,73.91 v78.5,73 | v91,80 91.25,80 91.41,79.84 U$51.ANODE 96.75,78 98.75,80 v99,80 | v103,80 103.25,80 103.41,79.84 U$59.ANODE | v67,80 67.41,79.59 U$35.ANODE | U1.7 71,68 v76,73
  Bottom 0.3: v39,80 v43,80 | v27,80 v31,80 | v51,80 v55,80 v67,80 v79,80 v91,80 | v99,80 v103,80 | v78.5,73 78,73.5 76.5,73.5 v76,73
ROW4  (via drill 0.35)
  Top 0.3: v39,68 38.75,68 36.75,66 U$12.ANODE 31.41,67.84 31.25,68 v31,68 | v43,68 43.25,68 43.41,67.84 U$20.ANODE v45,66 | U$4.ANODE 24.75,66 26.75,68 v27,68 | v90.75,68.5 91.41,67.84 U$52.ANODE 96.75,66 98.75,68 v99,68 | v103,68 103.25,68 103.41,67.84 U$60.ANODE | U$28.ANODE 55.41,69.16 55.5,69.06 v55.5,69 | U$36.ANODE 67.41,66.25 67.5,66.34 v67.5,68.1 68.8,69.4 U1.9 | v79,69 79.25,69 79.5,68.75 79.5,66.34 79.41,66.25 U$44.ANODE
  Bottom 0.3: v39,68 v43,68 | v27,68 v31,68 | v45,66 49,66 52,69 v55.5,69 64.5,69 65.4,68.1 v67.5,68.1 78.1,68.1 v79,69 90.25,69 v90.75,68.5 | v99,68 v103,68
ROW5  (via drill 0.35)
  Top 0.3: v39,52 39,52.25 37.25,54 U$13.ANODE 31.41,52.66 31,52.25 v31,52 | v43,52 43,52.25 43.41,52.66 U$21.ANODE 43.41,56.66 45.25,58.5 60.5,58.5 63.2,61.2 U1.25 | U$5.ANODE 25.25,54 27,52.25 v27,52 | v55,52 55,52.25 55.41,52.66 U$29.ANODE | v67,52 67,52.25 67.41,52.66 U$37.ANODE | v79,52 79,52.25 79.41,52.66 U$45.ANODE 85.25,54 87,52.25 v87,52 | v91,52 91,52.25 91.41,52.66 U$53.ANODE 97.25,54 99,52.25 v99,52 | v103,52 103,52.25 103.41,52.66 U$61.ANODE
  Bottom 0.3: v39,52 v43,52 v55,52 v67,52 v79,52 | v27,52 v31,52 | v87,52 v91,52 | v99,52 v103,52
ROW6  (via drill 0.35)
  Top 0.3: v39,40 39,40.5 37.5,42 U$14.ANODE 31.41,40.66 31,40.25 v31,40 | v43,40 43,40.25 43.41,40.66 U$22.ANODE | U$6.ANODE 25.25,42 27,40.25 v27,40 | v55,40 55,40.25 55.41,40.66 U$30.ANODE | v67,40 67,40.25 67.41,40.66 U$38.ANODE | v75,40 75,40.25 73.25,42 U$38.ANODE | v79,40 79,40.25 79.41,40.66 U$46.ANODE 85.25,42 87,40.25 v87,40 | v91,40 91,40.25 91.41,40.66 U$54.ANODE 97.25,42 99,40.25 v99,40 | v103,40 103,40.25 103.41,40.66 U$62.ANODE | U1.2 69,64 69,63 72.75,59.25 72.75,47.5 67.41,42.16 U$38.ANODE
  Bottom 0.3: v39,40 v43,40 v55,40 v67,40 | v27,40 v31,40 | v75,40 v79,40 | v87,40 v91,40 | v99,40 v103,40
ROW7  (via drill 0.35)
  Top 0.3: v39,28 37,30 U$15.ANODE 31.41,28.66 31,28.25 v31,28 | U$7.ANODE 25.25,30 27,28.25 v27,28 | v51,28 51,28.25 49.25,30 U$23.ANODE | v55,28 55,28.25 55.41,28.66 U$31.ANODE | v67,28 67,28.25 67.41,28.66 U$39.ANODE 73.25,30 75,28.25 v75,28 | v79,28 79,28.25 79.41,28.66 U$47.ANODE 85,30 85.24,30.01 87,28.25 v87,28 | v91,28 91,28.25 91.41,28.66 U$55.ANODE 97.25,30 99,28.25 v99,28 | v103,28 103,28.25 103.41,28.66 U$63.ANODE | v43,28 43.41,28.41 U$23.ANODE | U$23.ANODE 43.41,32.16 45,33.75 45,56.75 45.75,57.5 61,57.5 64,60.5 U1.26
  Bottom 0.3: v39,28 v43,28 | v27,28 v31,28 | v51,28 v55,28 v67,28 | v75,28 v79,28 | v87,28 v91,28 | v99,28 v103,28
ROW8  (via drill 0.35)
  Top 0.3: v39,16 39,16.25 37.25,18 U$16.ANODE 31.41,16.66 31,16.25 v31,16 | v43,16 43,16.25 43.41,16.66 U$24.ANODE 49.25,18 51,16.25 v51,16 | U$8.ANODE 25.25,18 27,16.25 v27,16 | v55,16 55,16.25 55.41,16.66 U$32.ANODE | U$32.ANODE 61.25,18 63,16.25 v63,16 | v67,16 67,16.25 67.41,16.66 U$40.ANODE 73.25,18 75,16.25 79,16.25 79.41,16.66 U$48.ANODE 85.25,18 87,16.25 91,16.25 91.41,16.66 U$56.ANODE v93,18 | v97,18 97.25,18 99,16.25 103,16.25 103.41,16.66 U$64.ANODE | U$32.ANODE 55.41,25.16 57,26.75 57,38.5 v62.5,44 | U1.32 72,58.51 72,48 v68,44
  Bottom 0.3: v39,16 v43,16 | v27,16 v31,16 | v51,16 v55,16 | v63,16 v67,16 | v93,18 v97,18 | v68,44 v62.5,44
SCK  (via drill 0.35)
  Top 0.3: U1.17 58,72.51 v58,87
  Bottom 0.3: J3.3 59.89,114.15 59.89,109.64 58,107.75 v58,87
SCL  (via drill 0.35)
  Top 0.3: U1.28 65.6,59.35 v64,57.75
  Bottom 0.3: v64,57.75 64,57 64.5,56.5 94.5,56.5 110,72 J1.3
SDA  (via drill 0.35)
  Top 0.3: U1.27 64.8,59.8 v61,56 | v111.5,71 111.5,73 113,74.5 113.96,74.5 J1.2
  Bottom 0.3: v61,56 61,54.75 62.5,53.25 94.25,53.25 111.5,70.5 v111.5,71
SWITCH  (via drill 0.35)
  Top 0.3: U1.11 67.2,75.2 72,80 v72,81.25 | v90.25,26.75 Q1.3 91.9,28.15 v93,29.25 | R12.1 v88.75,26.75 | v107.75,57.25 109.25,58.75 115.25,58.75 118.25,61.75 v118.25,99.25
  Bottom 0.3: v72,81.25 92.25,81.25 96.5,85.5 96.5,111 97.5,112 S1.1 105.5,112 v118.25,99.25 | v88.75,26.75 v90.25,26.75 | v93,29.25 100,36.25 106.25,36.25 107.75,37.75 v107.75,57.25
V_USB
  Top 0.5: J2.1 114.25,8.2 113.75,7.7 L1.1

### Text on the board
tPlace: GIZMO v1 | sgc / aug '19 | V+ | SDA | ATMEGA328-MU | SCL | NC | V- | 8 | 1
bPlace: VCC | MOSI | GND | MISO | SCK | RST | SET TIME | PLACE SERIAL HERE | 5V MICRO USB
200bmp: /Users/samchin/Downloads/Tulip Logo Flower (1).bmp